# EAGLE schematic Updated Design (EAGLE 8.4.0)
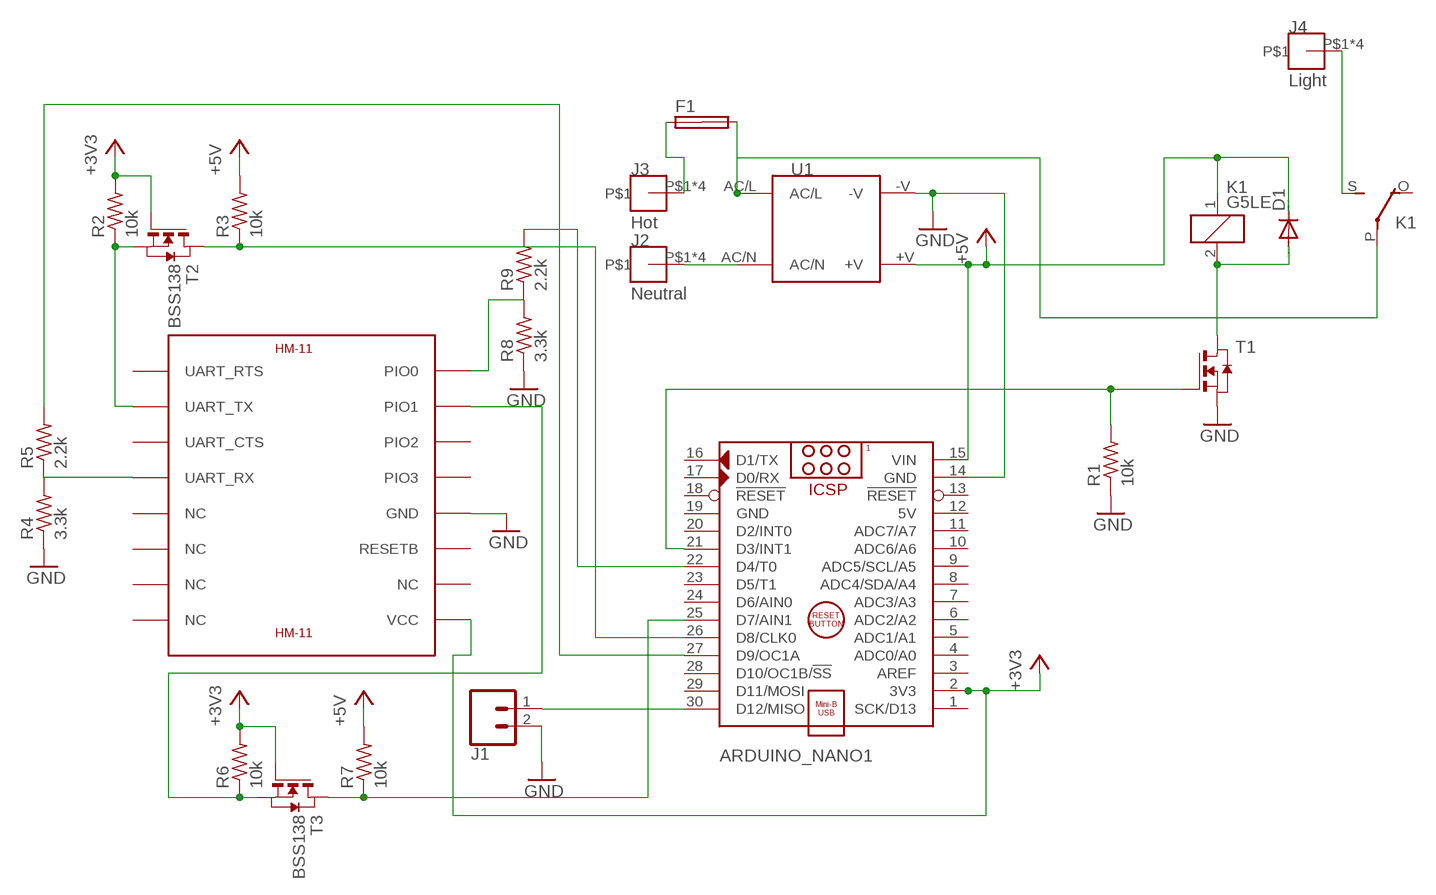
[diagram p0: schematic, sheet 1]

## Parts
ARDUINO_NANO1  ARDUINO_NANO  [ARDUINO_NANO]
D1  DIODE-SOD80C  [SOD80C]
F1  SHK20L  [SHK20L]
J1  CONN_025MM  [SCREWTERMINAL-5MM-2]
J2  Neutral  7700  [7700]
J3  Hot  7700  [7700]
J4  Light  7700  [7700]
K1  G5LE  [G5LE]
R1  10k  R-US_R0603  [R0603]
R2  10k  R-US_R0603  [R0603]
R3  10k  R-US_R0603  [R0603]
R4  3.3k  R-US_R0603  [R0603]
R5  2.2k  R-US_R0603  [R0603]
R6  10k  R-US_R0603  [R0603]
R7  10k  R-US_R0603  [R0603]
R8  3.3k  R-US_R0603  [R0603]
R9  2.2k  R-US_R0603  [R0603]
T1  NMOSSOT23  [SOT-23]
T2  BSS138  NMOSSOT23  [SOT-23]
T3  BSS138  NMOSSOT23  [SOT-23]
U1  IRM-05-5  [IRM-05]
U$1  HM-11  [HM-11]

## Nets
+3V3: ARDUINO_NANO1.2(3V3) R2.2 R6.2 T2.3(G) T3.3(G) U$1.VCC
+5V: ARDUINO_NANO1.15(VIN) D1.C K1.1 R3.2 R7.2 U1.+V
GND: ARDUINO_NANO1.14(GND) J1.2 U1.-V U$1.GND
N$1: ARDUINO_NANO1.30(D12/MISO) J1.1
N$2: R4.2 U$1.UART_RX
N$3: ARDUINO_NANO1.21(D3/INT1) T1.3(G)
N$4: F1.2A K1.P(2:P) U1.AC/L
N$5: J2.P$1 J2.P$2 J2.P$3 J2.P$4 U1.AC/N
N$6: J4.P$1 J4.P$2 J4.P$3 J4.P$4 K1.S(2:S)
N$7: ARDUINO_NANO1.27(D9/OC1A) R5.2
N$8: D1.A K1.2 T1.1(D)
N$9: R2.1 T2.2(S) U$1.UART_TX
N$10: ARDUINO_NANO1.26(D8/CLK0) R3.1 T2.1(D)
N$11: R6.1 T3.2(S) U$1.PIO1
N$12: ARDUINO_NANO1.25(D7/AIN1) R7.1 T3.1(D)
N$13: ARDUINO_NANO1.22(D4/T0) R9.2
N$14: R8.2 U$1.PIO0
N$15: F1.1A J3.P$1 J3.P$2 J3.P$3 J3.P$4
Unconnected: ARDUINO_NANO1.1(SCK/D13) ARDUINO_NANO1.3(AREF) ARDUINO_NANO1.4(ADC0/A0) ARDUINO_NANO1.5(ADC1/A1) ARDUINO_NANO1.6(ADC2/A2) ARDUINO_NANO1.7(ADC3/A3) ARDUINO_NANO1.8(ADC4/SDA/A4) ARDUINO_NANO1.9(ADC5/SCL/A5) ARDUINO_NANO1.10(ADC6/A6) ARDUINO_NANO1.11(ADC7/A7) ARDUINO_NANO1.13(!RESET) ARDUINO_NANO1.16(D1/TX) ARDUINO_NANO1.17(D0/RX) ARDUINO_NANO1.18(!RESET) ARDUINO_NANO1.20(D2/INT0) ARDUINO_NANO1.23(D5/T1) ARDUINO_NANO1.24(D6/AIN0) ARDUINO_NANO1.28(D10/OC1B/!SS) ARDUINO_NANO1.29(D11/MOSI) F1.1B F1.2B K1.O(2:O) R1.1 R1.2 R4.1 R5.1 R8.1 R9.1 T1.2(S) U$1.NC@5(NC) U$1.NC@6(NC) U$1.NC@7(NC) U$1.NC@8(NC) U$1.NC@10(NC) U$1.PIO2 U$1.PIO3 U$1.RESETB U$1.UART_CTS U$1.UART_RTS

## Power pins joined to a net without a drawn wire
5V: ARDUINO_NANO1.12(5V)
GND: ARDUINO_NANO1.19(GND)

## Library data of the parts
ARDUINO_NANO1 = ArduinoNanoV30:ARDUINO_NANO: Arduino Nano V3.0 Module Overview: The Arduino Nano is a small, complete, and breadboard-friendly board based on the ATmega328 (Arduino Nano 3.x) or ATmega168 (Arduino Nano 2.x). It has more or less the same functionality of the Arduino Duemilanove, but in a different package. It lacks only a DC power jack, and works with a Mini-B USB cable instead of a standard one. The Nano was designed and is being produced by Gravitech <http://www.gravitech.us/arna30wiatp.html>. General specifications: Item Value Microcontroller Atmel ATmega168 or ATmega328 Operating Voltage (logic level) 5 V Input Voltage (recommended) 7-12 V Input Voltage (limits) 6-20 V Digital I/O Pins 14 (of which 6 provide PWM output) Analog Input Pins 8 DC Current per I/O Pin 40 mA Flash Memory 16 KB (ATmega168) or 32 KB (ATmega328) of which 2 KB used by bootloader SRAM 1 KB (ATmega168) or 2 KB (ATmega328) EEPROM 512 bytes (ATmega168) or 1 KB (ATmega328) Clock Speed 16 MHz Dimensions (Inches) 0.73" x 1.70" Dimensions (mm) 18mm x 45mm Overall height About 9 mm (not including pins) Weigth 5 g Power: The Arduino Nano can be powered via the Mini-B USB connection, 6-20V unregulated external power supply (pin 30), or 5V regulated external power supply (pin 27). The power source is automatically selected to the highest voltage source. Memory: The ATmega168 has 16 KB of flash memory for storing code (of which 2 KB is used for the bootloader); the ATmega328 has 32 KB, (also with 2 KB used for the bootloader). The ATmega168 has 1 KB of SRAM and 512 bytes of EEPROM (which can be read and written with the EEPROM library); the ATmega328 has 2 KB of SRAM and 1 KB of EEPROM. Input and Output: Each of the 14 digital pins on the Nano can be used as an input or output, using pinMode(), digitalWrite(), and digitalRead() functions. They operate at 5 volts. Each pin can provide or receive a maximum of 40 mA and has an internal pull-up resistor (disconnected by default) of 20-50 kOhms. In addition, some pins have specialized functions. Visit Arduino - ArduinoBoardNano <https://www.arduino.cc/en/Main/ArduinoBoardNano>
D1 = diode:DIODE-: DIODE
F1 = fuse:SHK20L: FUSE HOLDER 5 x 20 mm, SH contact, SHH1 Schukat, E1073 Buerklin; OC_FARNELL: unknown; OC_NEWARK: unknown
J1 = SparkFun-Connectors:CONN_02: Multi connection point. Often used as Generic Header-pin footprint for 0.1 inch spaced/style header connections On any of the 0.1 inch spaced packages, you can populate with these: Break Away Headers - Straight <https://www.sparkfun.com/products/116> (PRT-00116) Break Away Male Headers - Right Angle <https://www.sparkfun.com/products/553> (PRT-00553) Female Headers <https://www.sparkfun.com/products/115> (PRT-00115) Break Away Headers - Machine Pin <https://www.sparkfun.com/products/117> (PRT-00117) Break Away Female Headers - Swiss Machine Pin <https://www.sparkfun.com/products/743> (PRT-00743) For SCREWTERMINALS and SPRING TERMINALS visit here: Screw Terimnals on SparkFun.com <https://www.sparkfun.com/search/results?term=Screw+Terminals> (5mm/3.5mm/2.54mm spacing) This device is also useful as a general connection point to wire up your design to another part of your project. Our various solder wires solder well into these plated through hole pads. Hook-Up Wire - Assortment (Stranded, 22 AWG) <https://www.sparkfun.com/products/11375> (PRT-11375) Hook-Up Wire - Assortment (Solid Core, 22 AWG) <https://www.sparkfun.com/products/11367> (PRT-11367) View the entire wire category on our website here <https://www.sparkfun.com/categories/141> Special notes: Molex polarized connector foot print use with: PRT-08233 with associated crimp pins and housings. 2.54_SCREWTERM for use with PRT-10571. 3.5mm Screw Terminal footprints for PRT-08084 5mm Screw Terminal footprints for use with PRT-08432; SF_SKU: PRT-08432
J2-J4 = Screw Terminal Keystone 7700:7700: 15A Screw Terminal Keystone 7700 <http://www.keyelco.com/product.cfm/Horizontal-Screw-Terminals/7700/product_id/1371>
K1 = relay:G5LE: RELAY 1 x switch, 10 A/120 V AC, 8 A/30 V DC, Omron; OC_FARNELL: unknown; OC_NEWARK: unknown
R1-R9 = resistor:R-US_: RESISTOR, American symbol
T1-T3 = zetex:NMOSSOT23: MOS FET; OC_FARNELL: unknown; OC_NEWARK: unknown
U1 = IRM-05:IRM-05-5: IRM-05-5 AC to 5VDC Specifications: Manufacturer: Mean Well Input Voltage: 85~264 VAC 120~370 VDC Input Frequency: 47~440 Hz Output Voltage: 5 V Output Current: 1 A IRM-05 Datasheet <http://www.mouser.com/ds/2/260/IRM-05-SPEC-806200.pdf>
U$1 = hm-11:HM-11: JNHuaMao HM-11 Bluetooth 4.0 Transceiver based on TI CC2540/CC2541